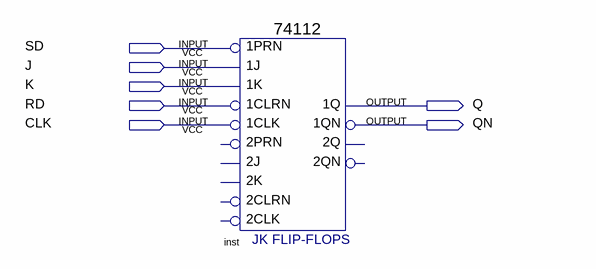
[diagram p0: schematic sheet]
// Quartus schematic jk.bdf as structural Verilog: 1 symbols, 7 pins
module jk (
  input  SD,
  input  J,
  input  K,
  input  RD,
  input  CLK,
  output Q,
  output QN
);

  \74112  inst (
    .\1K (K), .\1J (J), .\1PRN (SD), .\1CLK (CLK), .\1CLRN (RD), .\1QN (QN), .\1Q (Q));  // open: 2K, 2J, 2PRN, 2CLK, 2CLRN, 2Q, 2QN
endmodule
